# Altium schematic sheet BLDC_driver.SchDoc
size A2
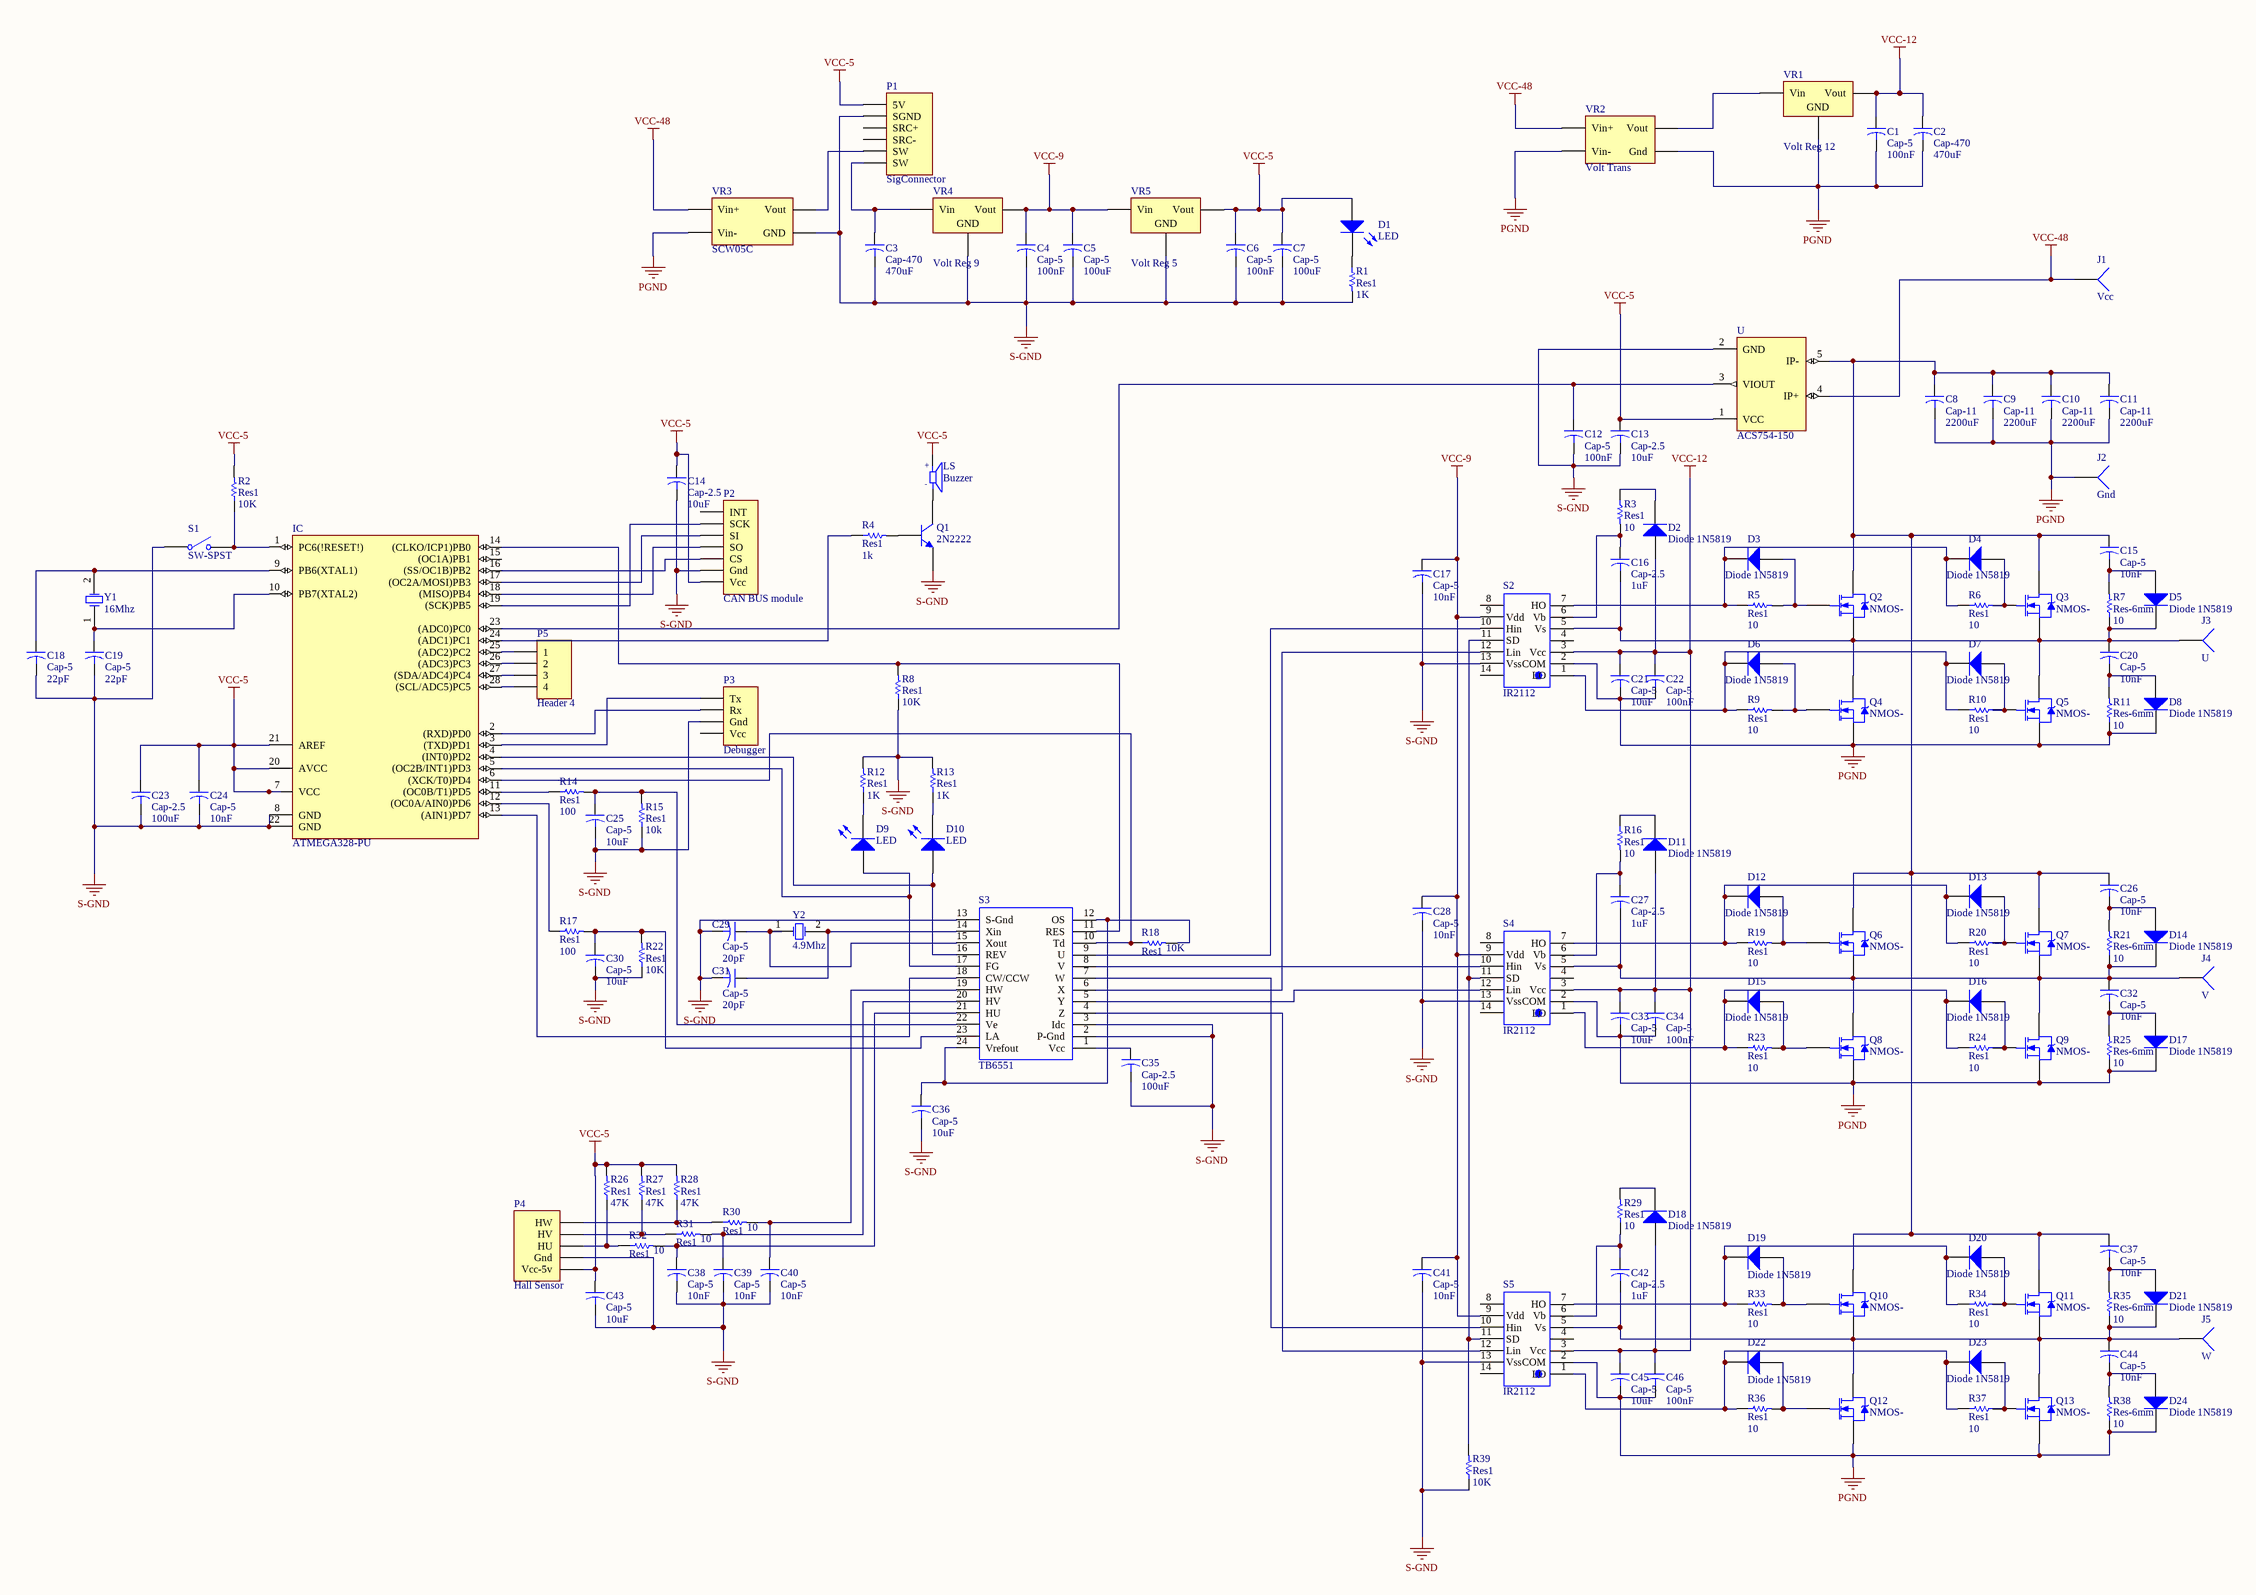
[diagram p0: BLDC_driver.SchDoc]

## Parts
C1  Cap-5  value 100nF  [CAP-5mm]
C2  Cap-470  value 470uF  [CAP-5-470]
C3  Cap-470  value 470uF  [CAP-5-470]
C4  Cap-5  value 100nF  [CAP-5mm]
C5  Cap-5  value 100uF  [CAP-5mm]
C6  Cap-5  value 100nF  [CAP-5mm]
C7  Cap-5  value 100uF  [CAP-5mm]
C8  Cap-11  value 2200uF  [CAP-11mm]
C9  Cap-11  value 2200uF  [CAP-11mm]
C10  Cap-11  value 2200uF  [CAP-11mm]
C11  Cap-11  value 2200uF  [CAP-11mm]
C12  Cap-5  value 100nF  [CAP-5mm]
C13  Cap-2.5  value 10uF  [CAP-2.5mm]
C14  Cap-2.5  value 10uF  [CAP-2.5mm]
C15  Cap-5  value 10nF  [CAP-5mm]
C16  Cap-2.5  value 1uF  [CAP-2.5mm]
C17  Cap-5  value 10nF  [CAP-5mm]
C18  Cap-5  value 22pF  [CAP-5mm]
C19  Cap-5  value 22pF  [CAP-5mm]
C20  Cap-5  value 10nF  [CAP-5mm]
C21  Cap-5  value 10uF  [CAP-5mm]
C22  Cap-5  value 100nF  [CAP-5mm]
C23  Cap-2.5  value 100uF  [CAP-2.5mm]
C24  Cap-5  value 10nF  [CAP-5mm]
C25  Cap-5  value 10uF  [CAP-5mm]
C26  Cap-5  value 10nF  [CAP-5mm]
C27  Cap-2.5  value 1uF  [CAP-2.5mm]
C28  Cap-5  value 10nF  [CAP-5mm]
C29  Cap-5  value 20pF  [CAP-5mm]
C30  Cap-5  value 10uF  [CAP-5mm]
C31  Cap-5  value 20pF  [CAP-5mm]
C32  Cap-5  value 10nF  [CAP-5mm]
C33  Cap-5  value 10uF  [CAP-5mm]
C34  Cap-5  value 100nF  [CAP-5mm]
C35  Cap-2.5  value 100uF  [CAP-2.5mm]
C36  Cap-5  value 10uF  [CAP-5mm]
C37  Cap-5  value 10nF  [CAP-5mm]
C38  Cap-5  value 10nF  [CAP-5mm]
C39  Cap-5  value 10nF  [CAP-5mm]
C40  Cap-5  value 10nF  [CAP-5mm]
C41  Cap-5  value 10nF  [CAP-5mm]
C42  Cap-2.5  value 1uF  [CAP-2.5mm]
C43  Cap-5  value 10uF  [CAP-5mm]
C44  Cap-5  value 10nF  [CAP-5mm]
C45  Cap-5  value 10uF  [CAP-5mm]
C46  Cap-5  value 100nF  [CAP-5mm]
D1  LED  [LED-2.5mm]
D2  Diode 1N5819  [DO-5mm]
D3  Diode 1N5819  [DO-5mm]
D4  Diode 1N5819  [DO-5mm]
D5  Diode 1N5819  [DO-5mm]
D6  Diode 1N5819  [DO-5mm]
D7  Diode 1N5819  [DO-5mm]
D8  Diode 1N5819  [DO-5mm]
D9  LED  [LED-2.5mm]
D10  LED  [LED-2.5mm]
D11  Diode 1N5819  [DO-5mm]
D12  Diode 1N5819  [DO-5mm]
D13  Diode 1N5819  [DO-5mm]
D14  Diode 1N5819  [DO-5mm]
D15  Diode 1N5819  [DO-5mm]
D16  Diode 1N5819  [DO-5mm]
D17  Diode 1N5819  [DO-5mm]
D18  Diode 1N5819  [DO-5mm]
D19  Diode 1N5819  [DO-5mm]
D20  Diode 1N5819  [DO-5mm]
D21  Diode 1N5819  [DO-5mm]
D22  Diode 1N5819  [DO-5mm]
D23  Diode 1N5819  [DO-5mm]
D24  Diode 1N5819  [DO-5mm]
IC  ATMEGA328-PU  [DIL28]
J1  Vcc  [Plug-high]
J2  Gnd  [Plug-high]
J3  U  [Plug-high]
J4  V  [Plug-high]
J5  W  [Plug-high]
LS  Buzzer  [CUI_CEM-1201(42)]
P1  SigConnector  [Sig Connector]
P2  CAN BUS module  [HDR1X7]
P3  Debugger  [HDR1X4]
P4  Hall Sensor  [Header-5]
P5  Header 4  [HDR1X4]
Q1  2N2222  [TO-92A]
Q2  NMOS-  [TO-220AB]
Q3  NMOS-  [TO-220AB]
Q4  NMOS-  [TO-220AB]
Q5  NMOS-  [TO-220AB]
Q6  NMOS-  [TO-220AB]
Q7  NMOS-  [TO-220AB]
Q8  NMOS-  [TO-220AB]
Q9  NMOS-  [TO-220AB]
Q10  NMOS-  [TO-220AB]
Q11  NMOS-  [TO-220AB]
Q12  NMOS-  [TO-220AB]
Q13  NMOS-  [TO-220AB]
R1  Res1  value 1K  [AXIAL-5mm]
R2  Res1  value 10K  [AXIAL-5mm]
R3  Res1  value 10  [AXIAL-5mm]
R4  Res1  value 1k  [AXIAL-5mm]
R5  Res1  value 10  [AXIAL-5mm]
R6  Res1  value 10  [AXIAL-5mm]
R7  Res-6mm  value 10  [DO-6mm]
R8  Res1  value 10K  [AXIAL-5mm]
R9  Res1  value 10  [AXIAL-5mm]
R10  Res1  value 10  [AXIAL-5mm]
R11  Res-6mm  value 10  [DO-6mm]
R12  Res1  value 1K  [AXIAL-5mm]
R13  Res1  value 1K  [AXIAL-5mm]
R14  Res1  value 100  [AXIAL-5mm]
R15  Res1  value 10k  [AXIAL-5mm]
R16  Res1  value 10  [AXIAL-5mm]
R17  Res1  value 100  [AXIAL-5mm]
R18  Res1  value 10K  [AXIAL-5mm]
R19  Res1  value 10  [AXIAL-5mm]
R20  Res1  value 10  [AXIAL-5mm]
R21  Res-6mm  value 10  [DO-6mm]
R22  Res1  value 10K  [AXIAL-5mm]
R23  Res1  value 10  [AXIAL-5mm]
R24  Res1  value 10  [AXIAL-5mm]
R25  Res-6mm  value 10  [DO-6mm]
R26  Res1  value 47K  [AXIAL-5mm]
R27  Res1  value 47K  [AXIAL-5mm]
R28  Res1  value 47K  [AXIAL-5mm]
R29  Res1  value 10  [AXIAL-5mm]
R30  Res1  value 10  [AXIAL-5mm]
R31  Res1  value 10  [AXIAL-5mm]
R32  Res1  value 10  [AXIAL-5mm]
R33  Res1  value 10  [AXIAL-5mm]
R34  Res1  value 10  [AXIAL-5mm]
R35  Res-6mm  value 10  [DO-6mm]
R36  Res1  value 10  [AXIAL-5mm]
R37  Res1  value 10  [AXIAL-5mm]
R38  Res-6mm  value 10  [DO-6mm]
R39  Res1  value 10K  [AXIAL-5mm]
S1  SW-SPST  [SPST-2]
S2  IR2112  [DIP-14]
S3  TB6551  [DIP12]
S4  IR2112  [DIP-14]
S5  IR2112  [DIP-14]
U  ACS754-150  [ACS754-150]
VR1  Volt Reg 12  [TO-220AB]
VR2  Volt Trans  [Volt Trans]
VR3  SCW05C  [KLD-0202]
VR4  Volt Reg 9  [TO-220AB]
VR5  Volt Reg 5  [TO-220AB]
Y1  16Mhz  [XTAL]
Y2  4.9Mhz  [XTAL]

## Nets
PGND: C1.2 C2.2 C8.2 C9.2 C10.2 C11.2 C21.2 C22.2 C33.2 C34.2 C45.2 C46.2 D8.2(K) D17.2(K) D24.2(K) J2.1 Q4.3(S) Q5.3(S) Q8.3(S) Q9.3(S) Q12.3(S) Q13.3(S) R11.1 R25.1 R38.1 S2.2(COM) S4.2(COM) S5.2(COM) VR1.2(GND) VR2.1(Vin-) VR2.3(Gnd) VR3.2(Vin-)
S-GND: C3.2 C4.2 C5.2 C6.2 C7.2 C12.2 C13.2 C14.2 C17.2 C18.2 C19.2 C23.2 C24.2 C25.2 C28.2 C29.2 C30.2 C31.2 C35.2 C36.2 C38.2 C39.2 C40.2 C41.2 C43.2 IC.8(GND) IC.22(GND) P1.2(SGND) P2.6(Gnd) P3.3(Gnd) P4.2(Gnd) Q1.3(E) R1.2 R8.1 R12.2 R13.2 R15.1 R22.1 R39.1 S1.1(COMMON) S2.13(Vss) S3.2(P-Gnd) S3.3(Idc) S3.13(S-Gnd) S4.13(Vss) S5.13(Vss) U.2(GND) VR3.4(GND) VR4.2(GND) VR5.2(GND)
VCC-5: C6.1 C7.1 C13.1 C14.1 C23.1 C24.1 C43.1 D1.1(A) IC.7(VCC) IC.20(AVCC) IC.21(AREF) LS.P P1.1(5V) P2.7(Vcc) P4.1(Vcc-5v) R2.2 R26.2 R27.2 R28.2 U.1(VCC) VR5.3(Vout)
VCC-9: C4.1 C5.1 C17.1 C28.1 C41.1 S2.9(Vdd) S4.9(Vdd) S5.9(Vdd) VR4.3(Vout) VR5.1(Vin)
VCC-12: C1.1 C2.1 C21.1 C22.1 C33.1 C34.1 C45.1 C46.1 D2.1(A) D11.1(A) D18.1(A) S2.3(Vcc) S4.3(Vcc) S5.3(Vcc) VR1.3(Vout)
VCC-48: J1.1 U.4(IP+) VR2.2(Vin+) VR3.1(Vin+)
NetC3_1: C3.1 P1.6(SW) VR4.1(Vin)
NetC8_1: C8.1 C9.1 C10.1 C11.1 C15.1 C26.1 C37.1 Q2.2(D) Q3.2(D) Q6.2(D) Q7.2(D) Q10.2(D) Q11.2(D) U.5(IP-)
NetC12_1: C12.1 IC.23((ADC0)PC0) U.3(VIOUT)
NetC15_2: C15.2 D5.1(A) R7.2
NetC16_1: C16.1 R3.2 S2.6(Vb)
NetC16_2: C16.2 C20.1 D5.2(K) J3.1 Q2.3(S) Q3.3(S) Q4.2(D) Q5.2(D) R7.1 S2.5(Vs)
NetC18_1: C18.1 IC.9(PB6(XTAL1)) Y1.2(OSC2)
NetC19_1: C19.1 IC.10(PB7(XTAL2)) Y1.1(OSC1)
NetC20_2: C20.2 D8.1(A) R11.2
NetC25_1: C25.1 R14.2 R15.2 S3.22(Ve)
NetC26_2: C26.2 D14.1(A) R21.2
NetC27_1: C27.1 R16.2 S4.6(Vb)
NetC27_2: C27.2 C32.1 D14.2(K) J4.1 Q6.3(S) Q7.3(S) Q8.2(D) Q9.2(D) R21.1 S4.5(Vs)
NetC29_1: C29.1 S3.15(Xout) Y2.1(OSC1)
NetC30_1: C30.1 R17.2 R22.2 S3.23(LA)
NetC31_1: C31.1 S3.14(Xin) Y2.2(OSC2)
NetC32_2: C32.2 D17.1(A) R25.2
NetC35_1: C35.1 S3.1(Vcc)
NetC36_1: C36.1 R18.2 S3.12(OS) S3.24(Vrefout)
NetC37_2: C37.2 D21.1(A) R35.2
NetC38_1: C38.1 R32.2 S3.21(HU)
NetC39_1: C39.1 R31.2 S3.20(HV)
NetC40_1: C40.1 R30.2 S3.19(HW)
NetC42_1: C42.1 R29.1 S5.6(Vb)
NetC42_2: C42.2 C44.1 D21.2(K) J5.1 Q10.3(S) Q11.3(S) Q12.2(D) Q13.2(D) R35.1 S5.5(Vs)
NetC44_2: C44.2 D24.1(A) R38.2
NetD1_2: D1.2(K) R1.1
NetD2_2: D2.2(K) R3.1
NetD3_1: D3.1(A) Q2.1(G) R5.2
NetD3_2: D3.2(K) D4.2(K) R5.1 R6.1 S2.7(HO)
NetD4_1: D4.1(A) Q3.1(G) R6.2
NetD6_1: D6.1(A) Q4.1(G) R9.2
NetD6_2: D6.2(K) D7.2(K) R9.1 R10.1 S2.1(LO)
NetD7_1: D7.1(A) Q5.1(G) R10.2
NetD9_1: D9.1(A) IC.5((OC2B/INT1)PD3) S3.17(FG)
NetD9_2: D9.2(K) R12.1
NetD10_1: D10.1(A) IC.4((INT0)PD2) S3.16(REV)
NetD10_2: D10.2(K) R13.1
NetD11_2: D11.2(K) R16.1
NetD12_1: D12.1(A) Q6.1(G) R19.2
NetD12_2: D12.2(K) D13.2(K) R19.1 R20.1 S4.7(HO)
NetD13_1: D13.1(A) Q7.1(G) R20.2
NetD15_1: D15.1(A) Q8.1(G) R23.2
NetD15_2: D15.2(K) D16.2(K) R23.1 R24.1 S4.1(LO)
NetD16_1: D16.1(A) Q9.1(G) R24.2
NetD18_2: D18.2(K) R29.2
NetD19_1: D19.1(A) Q10.1(G) R33.2
NetD19_2: D19.2(K) D20.2(K) R33.1 R34.1 S5.7(HO)
NetD20_1: D20.1(A) Q11.1(G) R34.2
NetD22_1: D22.1(A) Q12.1(G) R36.2
NetD22_2: D22.2(K) D23.2(K) R36.1 R37.1 S5.1(LO)
NetD23_1: D23.1(A) Q13.1(G) R37.2
NetIC_1: IC.1(PC6(!RESET!)) R2.1 S1.2(NO)
NetIC_2: IC.2((RXD)PD0) P3.2(Rx)
NetIC_3: IC.3((TXD)PD1) P3.1(Tx)
NetIC_6: IC.6((XCK/T0)PD4) R18.1 S3.10(Td)
NetIC_11: IC.11((OC0B/T1)PD5) R14.1
NetIC_12: IC.12((OC0A/AIN0)PD6) R17.1
NetIC_13: IC.13((AIN1)PD7) S3.18(CW/CCW)
NetIC_14: IC.14((CLKO/ICP1)PB0) R8.2 S3.11(RES)
NetIC_16: IC.16((SS/OC1B)PB2) P2.5(CS)
NetIC_17: IC.17((OC2A/MOSI)PB3) P2.3(SI)
NetIC_18: IC.18((MISO)PB4) P2.4(SO)
NetIC_19: IC.19((SCK)PB5) P2.2(SCK)
NetIC_24: IC.24((ADC1)PC1) R4.1
NetIC_25: IC.25((ADC2)PC2) P5.1
NetIC_26: IC.26((ADC3)PC3) P5.2
NetIC_27: IC.27((SDA/ADC4)PC4) P5.3
NetIC_28: IC.28((SCL/ADC5)PC5) P5.4
NetLS_M: LS.M Q1.1(C)
NetP1_5: P1.5(SW) VR3.3(Vout)
NetP4_3: P4.3(HU) R26.1 R32.1
NetP4_4: P4.4(HV) R27.1 R31.1
NetP4_5: P4.5(HW) R28.1 R30.1
NetQ1_2: Q1.2(B) R4.2
NetR39_2: R39.2 S2.11(SD) S4.11(SD) S5.11(SD)
NetS2_10: S2.10(Hin) S3.9(U)
NetS2_12: S2.12(Lin) S3.6(X)
NetS3_4: S3.4(Z) S5.12(Lin)
NetS3_5: S3.5(Y) S4.12(Lin)
NetS3_7: S3.7(W) S5.10(Hin)
NetS3_8: S3.8(V) S4.10(Hin)
NetVR1_1: VR1.1(Vin) VR2.4(Vout)

Not connected (* = marked no-connect by the designer): IC 15((OC1A)PB1); P1 3(SRC+) 4(SRC-); P2 1(INT); P3 4(Vcc); S2 4(NC) 8(NC) 14(NC); S4 4(NC) 8(NC) 14(NC); S5 4(NC) 8(NC) 14(NC)

## Notes on the sheet
- (in symbol Buzzer) +; -

## Library data of the parts
C1 C4-C7 C12 C15 C17-C22 C24-C26 C28-C34 C36-C41 C43-C46 = Cap-5: Capacitor; Published: 23-Sep-2002; PackageReference: CAPR5-4X5; Publisher: Altium Limited; PackageDescription: Capacitor; 2 Leads
C2 C3 = Cap-470: Capacitor; Published: 23-Sep-2002; PackageReference: CAPR5-4X5; Publisher: Altium Limited; PackageDescription: Capacitor; 2 Leads
C8-C11 = Cap-11: Capacitor; Published: 23-Sep-2002; PackageReference: CAPR5-4X5; Publisher: Altium Limited; PackageDescription: Capacitor; 2 Leads
C13 C14 C16 C23 C27 C35 C42 = Cap-2.5: Capacitor; Published: 23-Sep-2002; PackageReference: CAPR5-4X5; Publisher: Altium Limited; PackageDescription: Capacitor; 2 Leads
D1 D9 D10 = LED0: Typical LED; Published: 8-Jun-2000; LatestRevisionDate: 08-Jul-2005; LatestRevisionNote: Mech Layer 1 removed.; PackageReference: LED-0; Publisher: Altium Limited; PackageDescription: LED; 2 Leads
D2-D4 D6 D7 D11-D13 D15 D16 D18-D20 D22 D23 = Diode 1N5408: 3 Amp Medium Power Silicon Rectifier Diode; Published: 8-Jun-2000; LatestRevisionDate: 17-Jul-2002; LatestRevisionNote: Re-released for DXP Platform.; DatasheetVersion: Aug-1984; PackageReference: DO-201AD; Publisher: Altium Limited; PackageDescription: Diode, Axial; Body 9.5 x 5.3 mm (LxDia. max), Lead Dia. 1.32 mm (max); ComponentLink1Description: Manufacturer Link; ComponentLink1URL: http://www.irf.com/
D5 D8 D14 D17 D21 D24 = Diode 1N4001: 3 Amp Medium Power Silicon Rectifier Diode; Published: 8-Jun-2000; LatestRevisionDate: 17-Jul-2002; LatestRevisionNote: Re-released for DXP Platform.; DatasheetVersion: Aug-1984; PackageReference: DO-201AD; Publisher: Altium Limited; PackageDescription: Diode, Axial; Body 9.5 x 5.3 mm (LxDia. max), Lead Dia. 1.32 mm (max); ComponentLink1Description: Manufacturer Link; ComponentLink1URL: http://www.irf.com/
IC = ATMEGA328-PU: AVR AVRÂ® ATmega Microcontroller IC 8-Bit 20MHz 32KB _16K x 16_ FLASH 28-PDIP; MF: Microchip Technology; Package: DIP-28 Microchip Technology; Price: None; Availability: Unavailable; MP: ATMEGA328-PU; SnapEDA_Link: https://www.snapeda.com/parts/ATMEGA328-PU/Microchip/view-part/4327846/?ref=snap; Value: *
J1-J5 = Socket: LatestRevisionDate: 17-Jul-2002; LatestRevisionNote: Re-released for DXP Platform.; Publisher: Altium Limited
LS = Buzzer: Buzzer, 12 mm, 1,5 V, 85 dB; MF: CUI Devices; MP: CEM-1201_42_; CUI_purchase_URL: https://www.cuidevices.com/product/audio/buzzers/audio-transducers/cem-1201_42_?utm_source=snapeda.com&utm_medium=referral&utm_campaign=snapedaBOM; Price: None; SnapEDA_Link: https://www.snapeda.com/parts/CEM-1201%2842%29/CUI%20Devices/view-part/2755977/?ref=snap; Value: *; Availability: Unavailable; Package: CUI Inc.
P1 = SigConnector: Header, 6-Pin; LatestRevisionDate: 17-Jul-2002; LatestRevisionNote: Re-released for DXP Platform.; Publisher: Altium Limited
P2 = CAN BUS module: Header, 7-Pin; LatestRevisionDate: 17-Jul-2002; LatestRevisionNote: Re-released for DXP Platform.; Publisher: Altium Limited
P3 = Debugger: Header, 4-Pin; LatestRevisionDate: 17-Jul-2002; LatestRevisionNote: Re-released for DXP Platform.; Publisher: Altium Limited
P4 = Hall Sensor: Header, 5-Pin; LatestRevisionDate: 17-Jul-2002; LatestRevisionNote: Re-released for DXP Platform.; Publisher: Altium Limited
P5 = Header 4: Header, 4-Pin; LatestRevisionDate: 17-Jul-2002; LatestRevisionNote: Re-released for DXP Platform.; Publisher: Altium Limited
Q1 = 2N2222: NPN General Purpose Amplifier; Published: 8-Jun-2000; LatestRevisionDate: 15-Jan-2003; LatestRevisionNote: PCB Footprint 'BCY-W3/D4.7' replaced; DatasheetVersion: 1997; PackageVersion: Sep-1998; PackageReference: TO-92A; Publisher: Altium Limited; PackageDescription: TO, Flat Index; 3 In-Line, Axial Leads; Body Dia. 4.5mm; Leads 0.51 x 0.48 mm (max); ComponentLink1Description: Manufacturer Link; ComponentLink1URL: http://www.fairchildsemi.com/; ComponentLink2Description: Datasheet; ComponentLink2URL: http://www.fairchildsemi.com/ds/2N%2F2N3904.pdf
Q2-Q13 = NMOS-: IRFB4110; Note: Pin 2 is electrically connected to pin 4.; Published: 8-Jun-2000; LatestRevisionDate: 17-Jul-2002; LatestRevisionNote: Re-released for DXP Platform.; DatasheetVersion: PD-9.814; PackageVersion: Feb-1997; PackageReference: TO-220AB; Publisher: Altium Limited; PackageDescription: TO, Thru-Hole, Vertical, Heatsink Mounted; 3 In-Line Leads; Pitch 2.54 mm; ComponentLink1Description: Manufacturer Link; ComponentLink1URL: http://www.irf.com/
R1-R6 R8-R10 R12-R20 R22-R24 R26-R34 R36 R37 R39 = Res1: Resistor; Published: 8-Jun-2000; LatestRevisionDate: 17-Jul-2002; LatestRevisionNote: Re-released for DXP Platform.; PackageReference: AXIAL-0.3; Publisher: Altium Limited; PackageDescription: Axial Device, Thru-Hole; 2 Leads; 0.3 in Pin Spacing
R7 R11 R21 R25 R35 R38 = Res-6mm: Resistor; Published: 8-Jun-2000; LatestRevisionDate: 17-Jul-2002; LatestRevisionNote: Re-released for DXP Platform.; PackageReference: AXIAL-0.3; Publisher: Altium Limited; PackageDescription: Axial Device, Thru-Hole; 2 Leads; 0.3 in Pin Spacing
S1 = SW-SPST: Single-Pole, Single-Throw Switch; Published: 24-Mar-1999; LatestRevisionDate: 17-Jul-2002; LatestRevisionNote: Re-released for DXP Platform.; PackageReference: SPST-2; Publisher: Altium Limited; PackageDescription: Switch; 2 Leads
S2 S4 S5 = SW DIP-7: DIP Switch, 7 Position, SPST; Published: 24-Mar-1999; LatestRevisionDate: 17-Jul-2002; LatestRevisionNote: Re-released for DXP Platform.; PackageReference: DIP-14; Publisher: Altium Limited; Code_JEDEC: MO-001-AF
S3 = TB6551: DIP Switch, 8 Position, SPST; Published: 24-Mar-1999; LatestRevisionDate: 17-Jul-2002; LatestRevisionNote: Re-released for DXP Platform.; PackageReference: DIP_SW_8WAY_SMD; Publisher: Altium Limited; PackageDescription: DIP Switch; 16 Leads
U = ACS754-150: Current Sensor 50A 1 Channel Hall Effect, Open Loop Unidirectional 5-CB Formed Leads, PFF; MP: ACS758; MF: Allegro MicroSystems LLC; Package: 5-CB-5 Allegro MicroSystems LLC; Availability: Unavailable; Price: None; Value: *; SnapEDA_Link: https://www.snapeda.com/parts/ACS758/Allegro%20MicroSystems%20LLC/view-part/226237/?ref=snap
VR1 = Volt Reg 12: Voltage Regulator; Published: 24-Mar-1999; LatestRevisionDate: 29-May-2009; LatestRevisionNote: IPC-7351 Footprint Added.; PackageReference: D2PAK; Publisher: Altium Limited; PackageDescription: 3-Pin Transistor Outline Package 2.54 mm Pitch, 15.1 mm Lead Span
VR2 = Volt Trans: Voltage Regulator; Published: 24-Mar-1999; LatestRevisionDate: 29-May-2009; LatestRevisionNote: IPC-7351 Footprint Added.; PackageReference: D2PAK; Publisher: Altium Limited; PackageDescription: 3-Pin Transistor Outline Package 2.54 mm Pitch, 15.1 mm Lead Span
VR3 = SCW05C: Voltage Regulator; Published: 24-Mar-1999; LatestRevisionDate: 29-May-2009; LatestRevisionNote: IPC-7351 Footprint Added.; PackageReference: D2PAK; Publisher: Altium Limited; PackageDescription: 3-Pin Transistor Outline Package 2.54 mm Pitch, 15.1 mm Lead Span
VR4 = Volt Reg 9: Voltage Regulator; Published: 24-Mar-1999; LatestRevisionDate: 29-May-2009; LatestRevisionNote: IPC-7351 Footprint Added.; PackageReference: D2PAK; Publisher: Altium Limited; PackageDescription: 3-Pin Transistor Outline Package 2.54 mm Pitch, 15.1 mm Lead Span
VR5 = Volt Reg 5: Voltage Regulator; Published: 24-Mar-1999; LatestRevisionDate: 29-May-2009; LatestRevisionNote: IPC-7351 Footprint Added.; PackageReference: D2PAK; Publisher: Altium Limited; PackageDescription: 3-Pin Transistor Outline Package 2.54 mm Pitch, 15.1 mm Lead Span
Y1 Y2 = XTAL: Crystal Oscillator; Published: 8-Jun-2000; LatestRevisionDate: 17-Jul-2002; LatestRevisionNote: Re-released for DXP Platform.; PackageReference: R38; Publisher: Altium Limited; PackageDescription: Crystal, Thru-Hole; 2 Leads; Body 3.1 x 8.2 mm (Dia.xH)